# EAGLE schematic magarray_v1 (EAGLE 6.5.0)
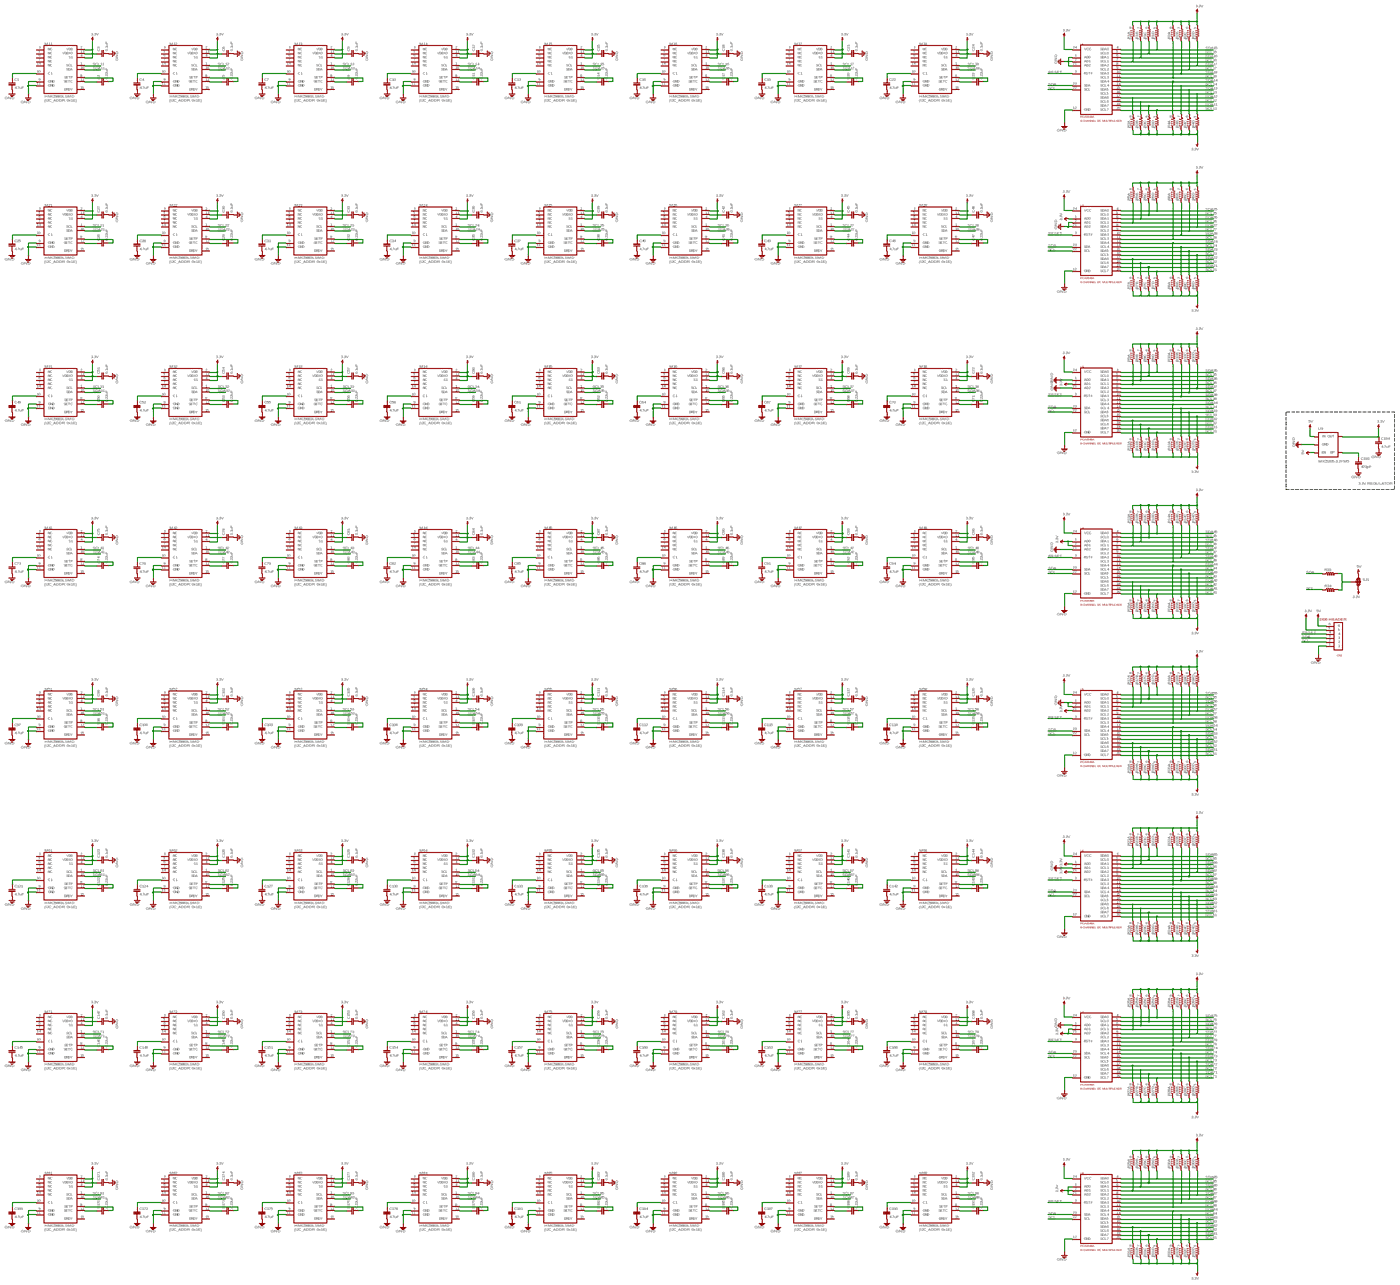
[diagram p0: schematic, sheet 1, overview]
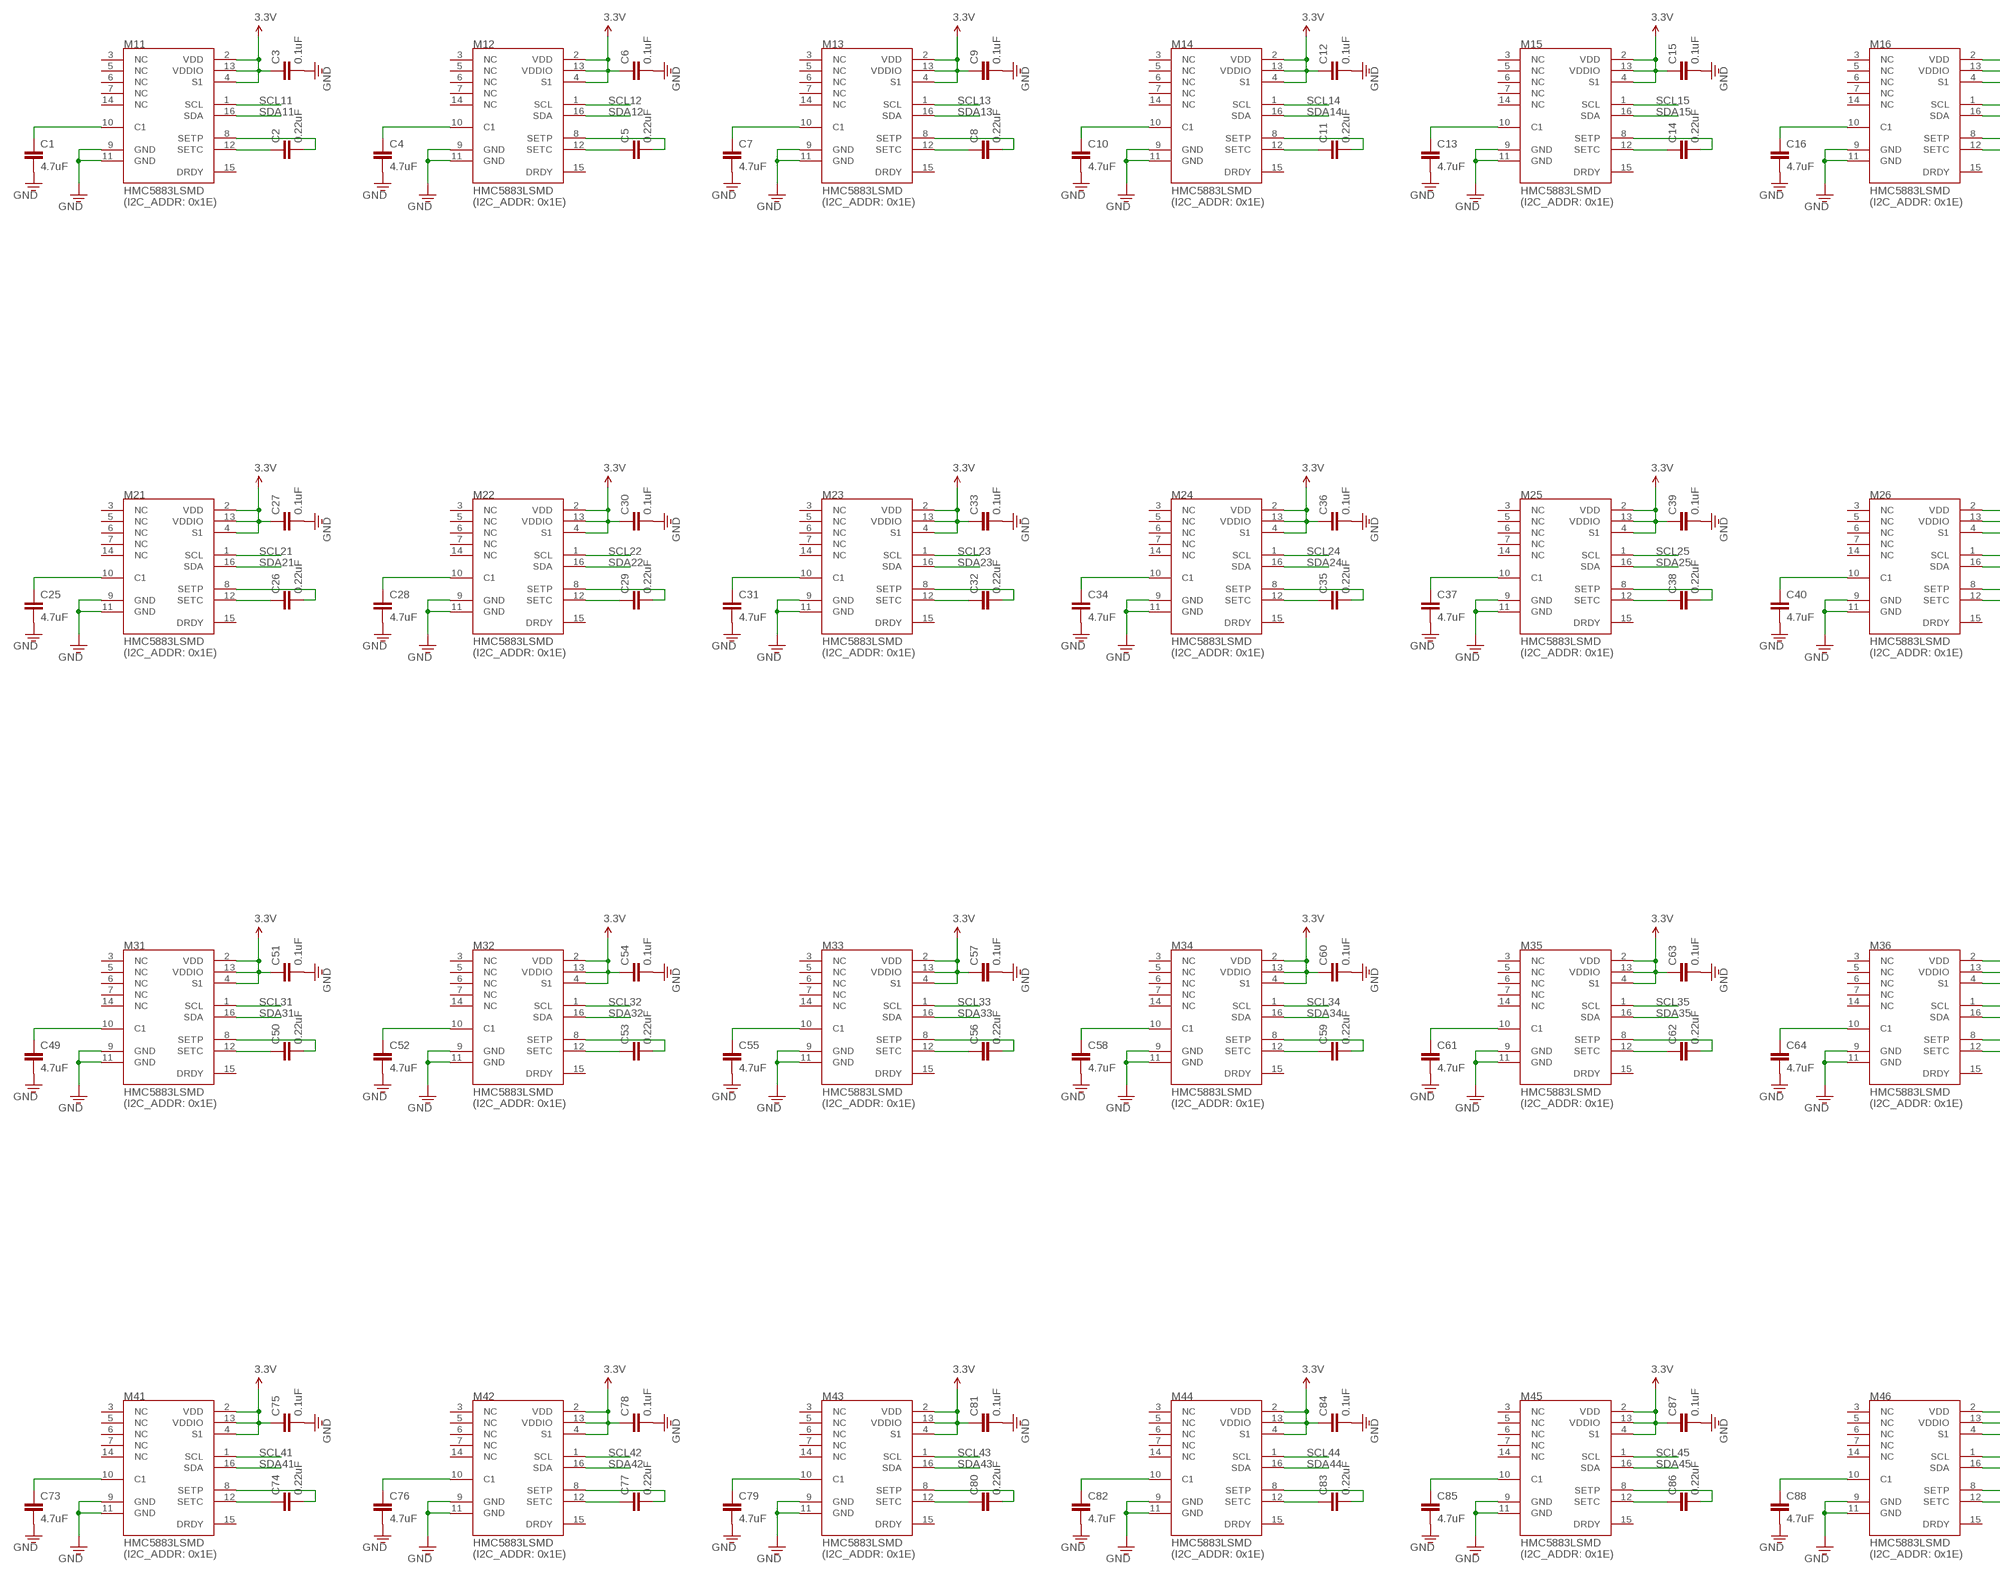
[diagram p1: schematic, sheet 1, part 1 of 4]
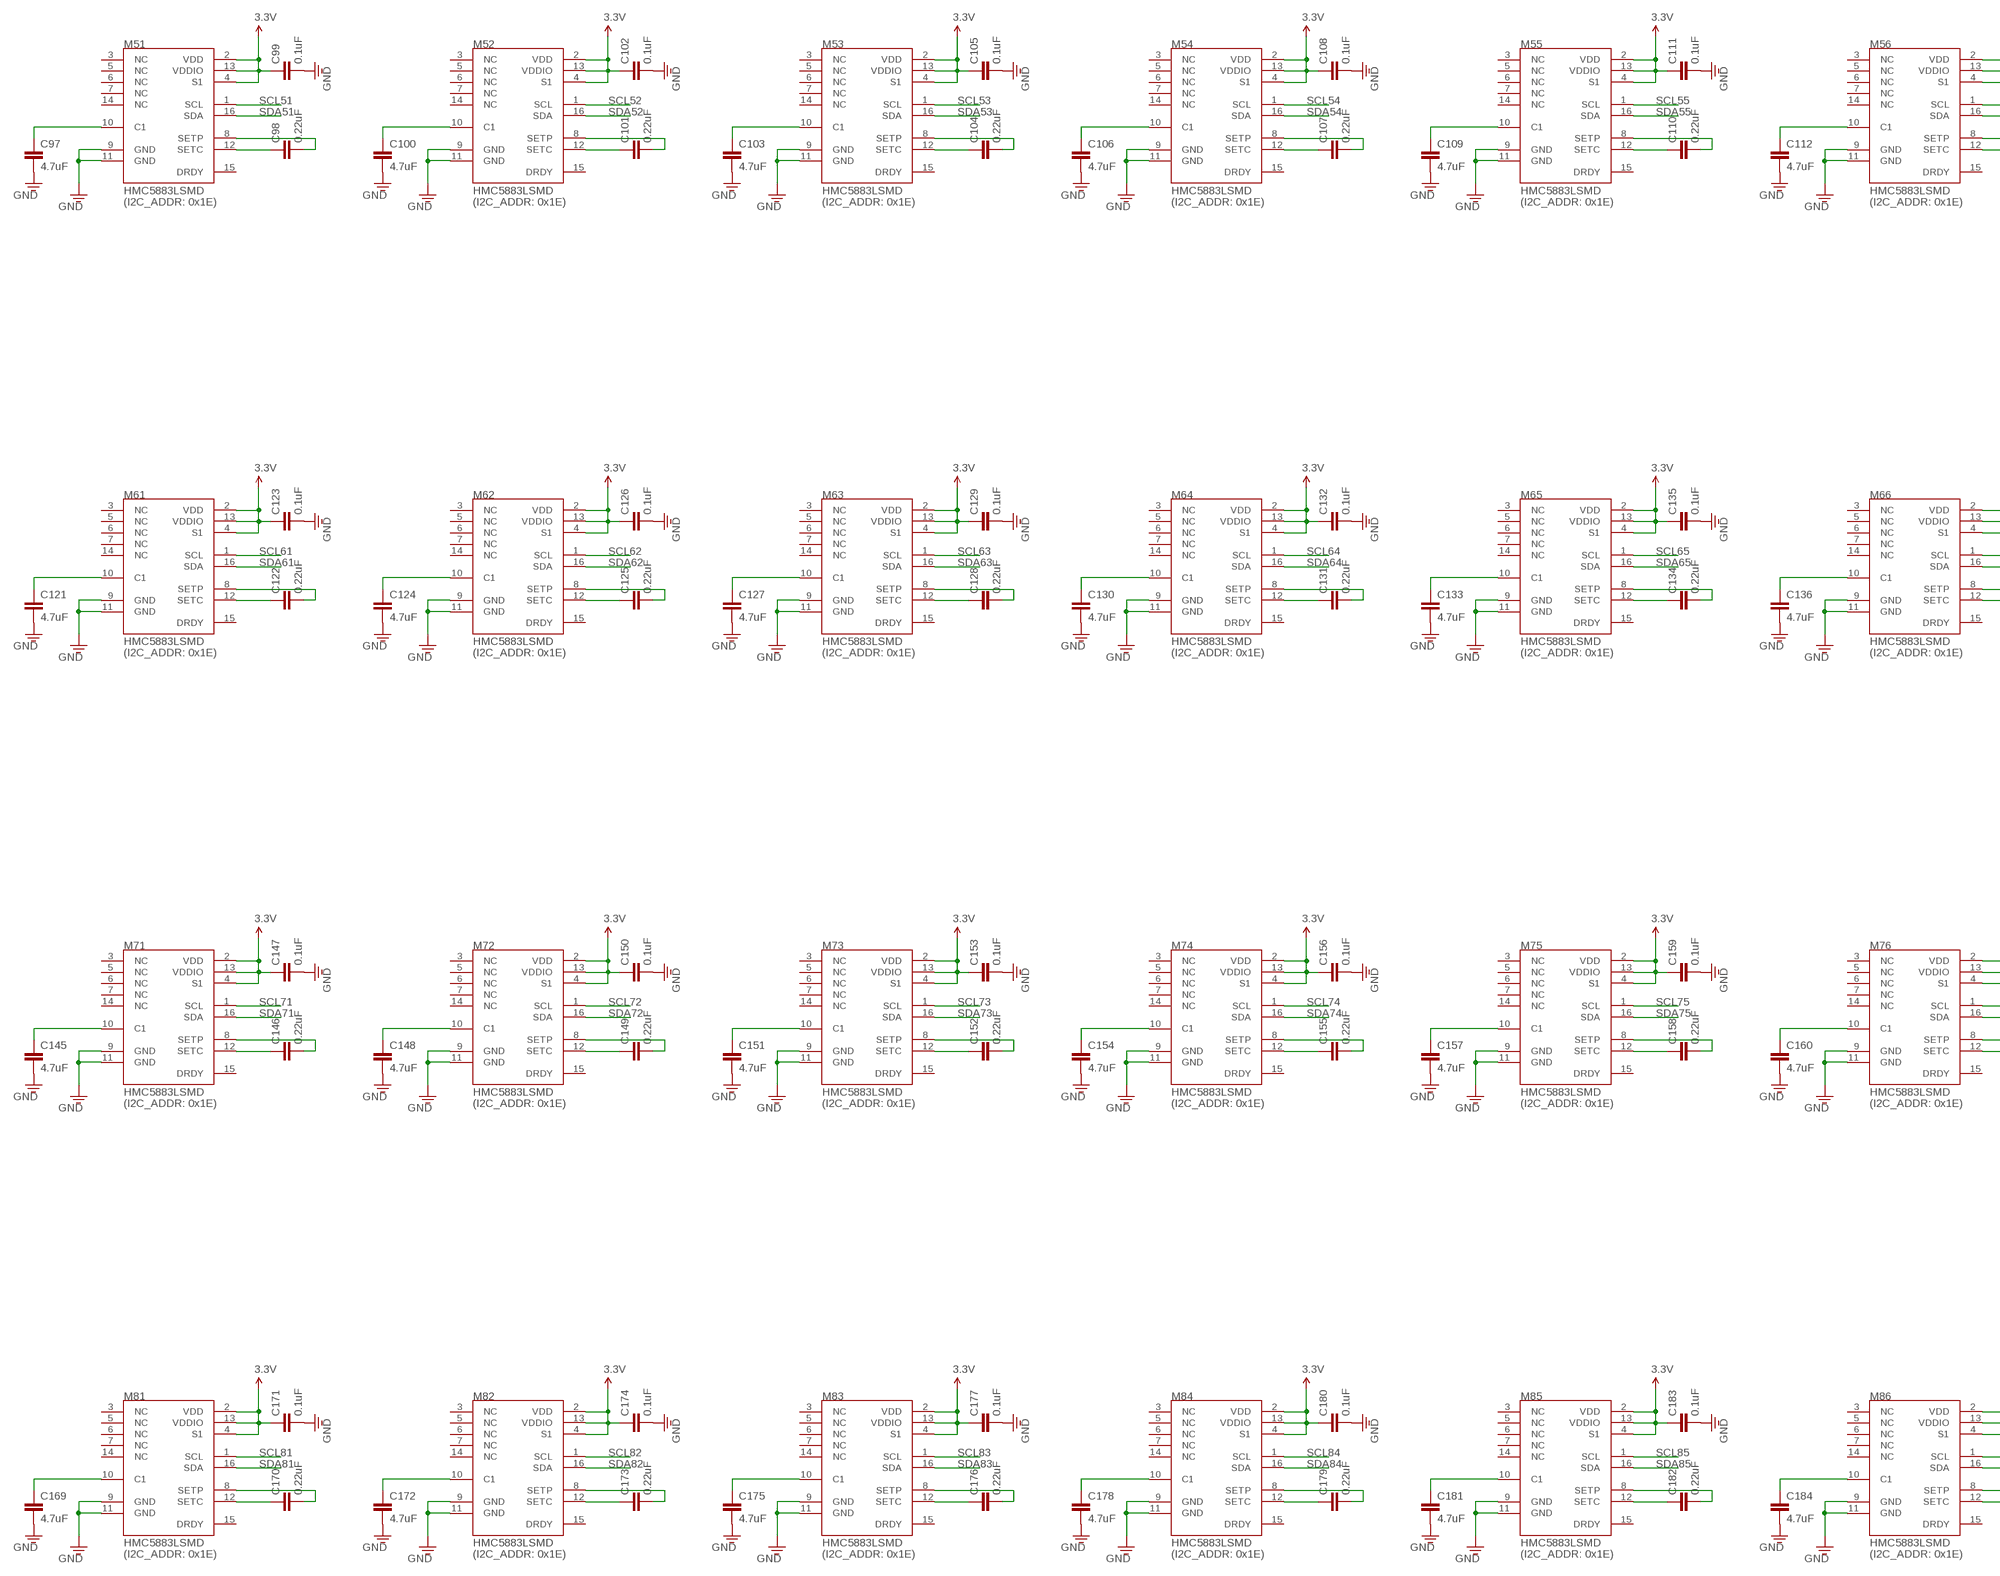
[diagram p2: schematic, sheet 1, part 2 of 4]
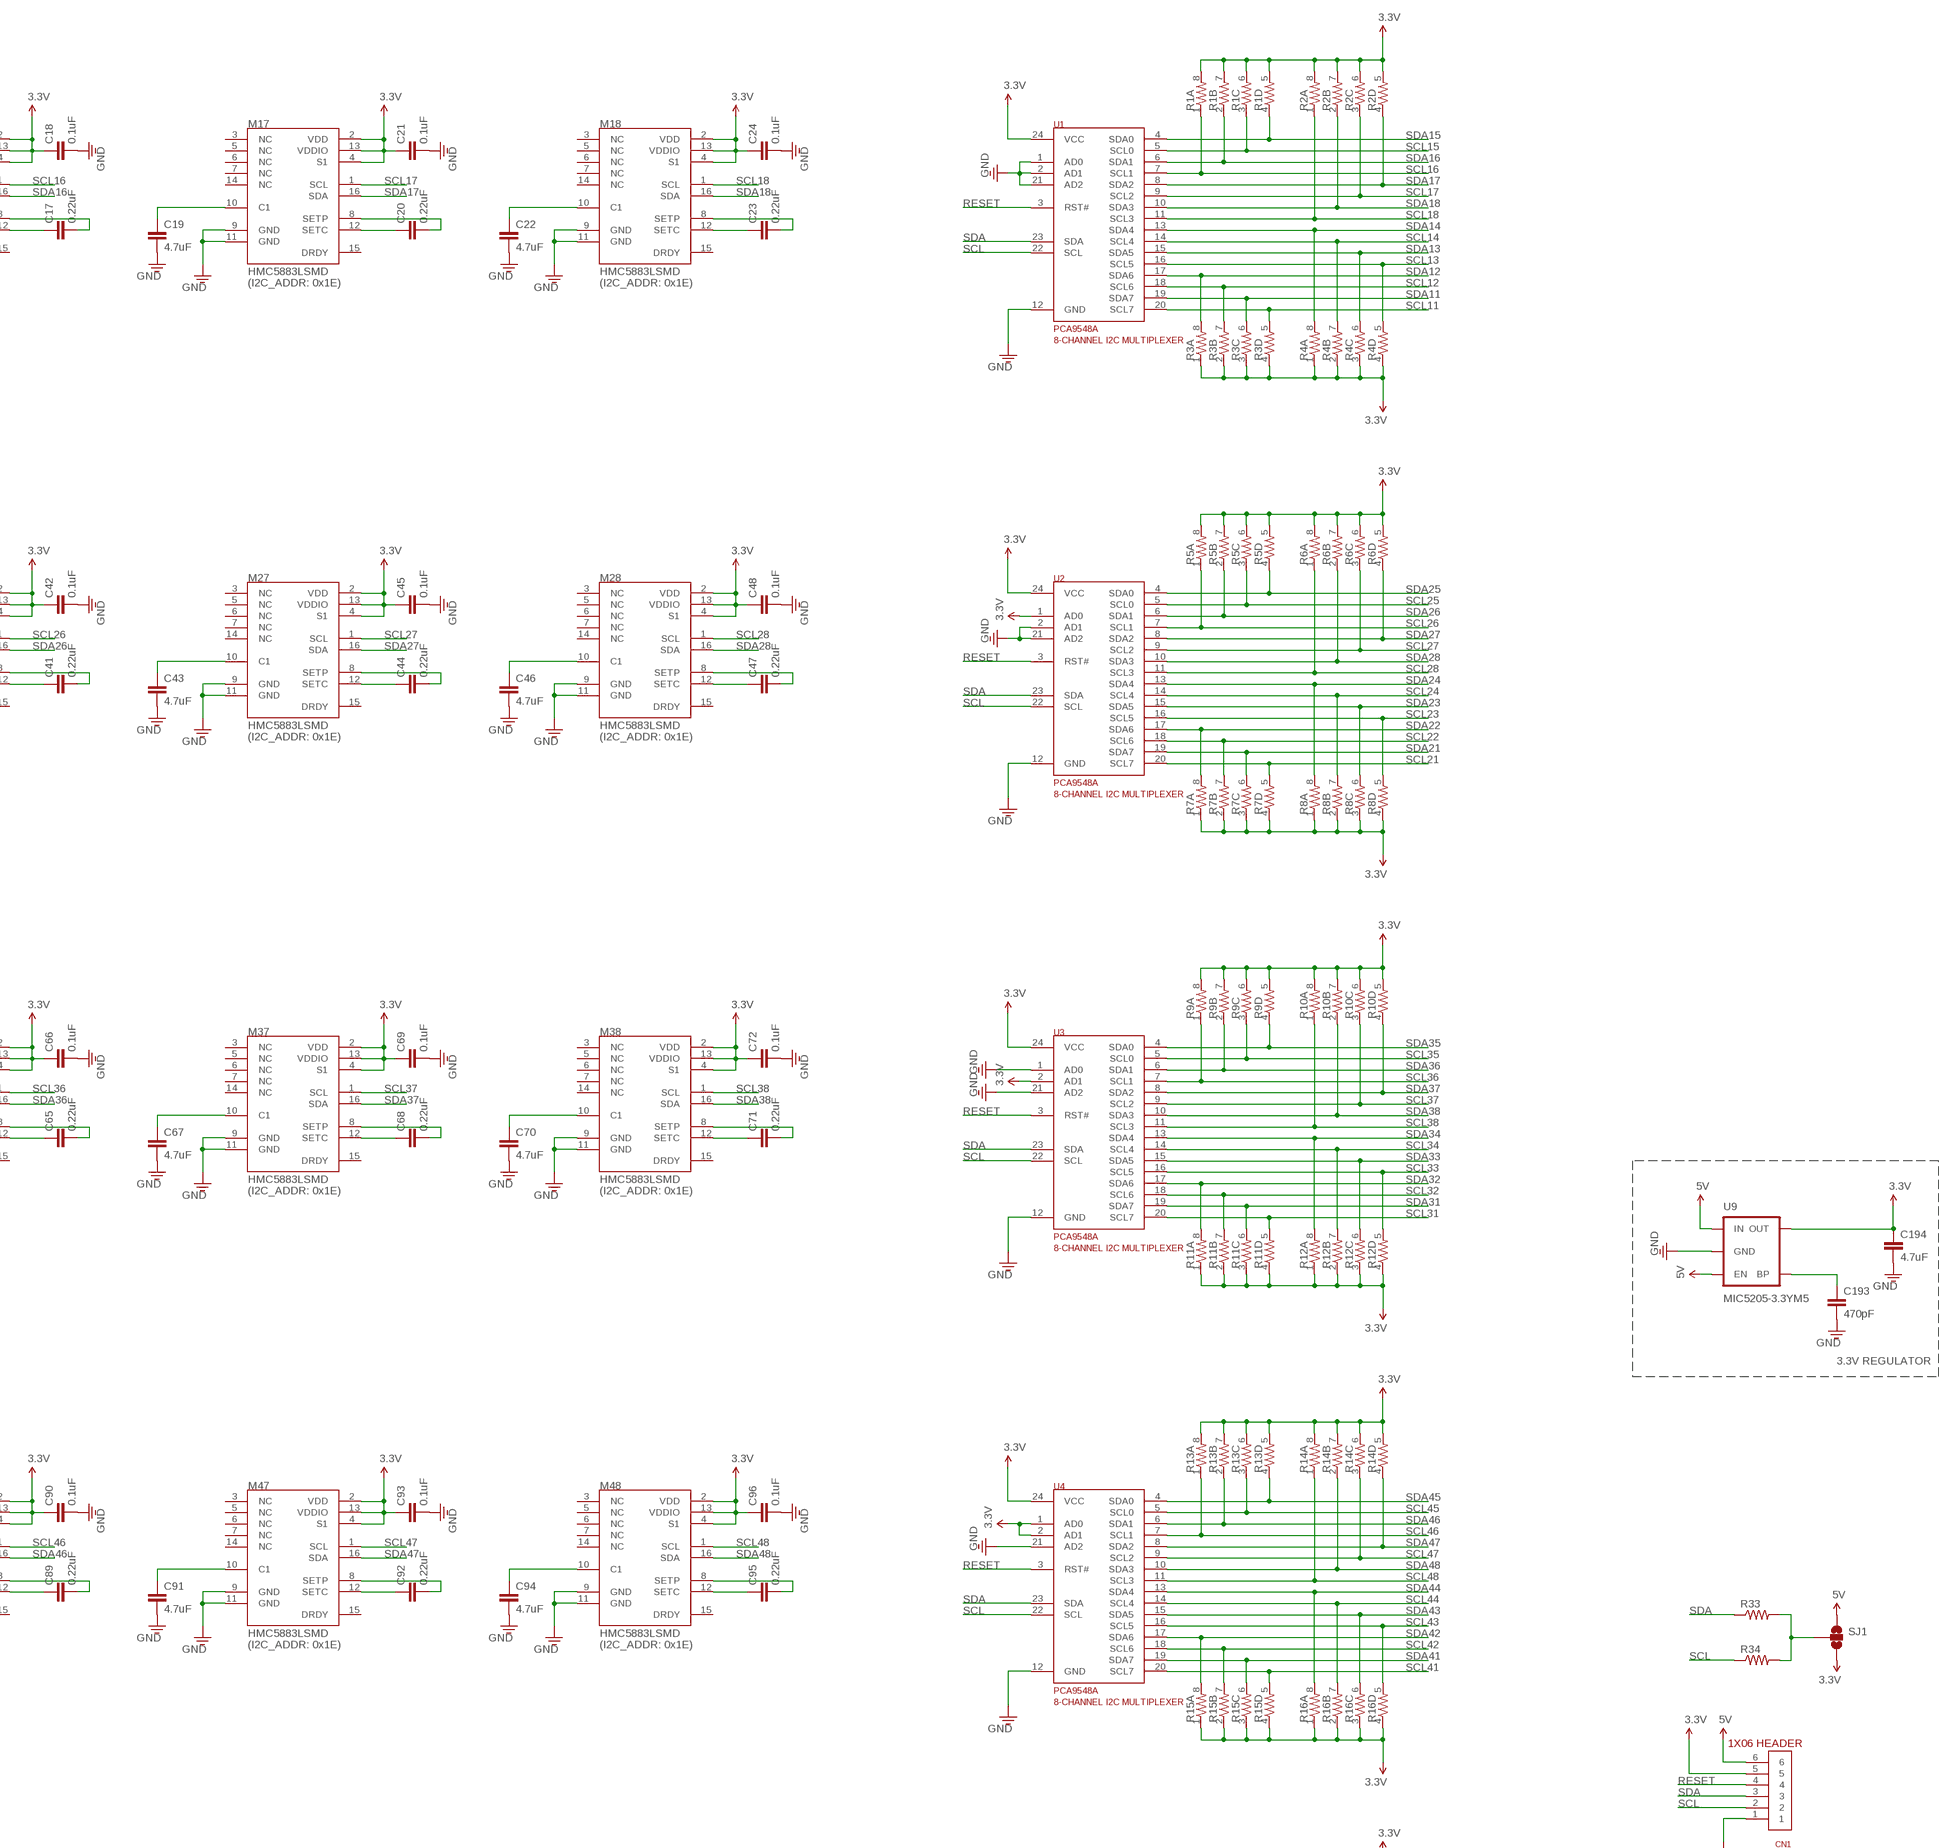
[diagram p3: schematic, sheet 1, part 3 of 4]
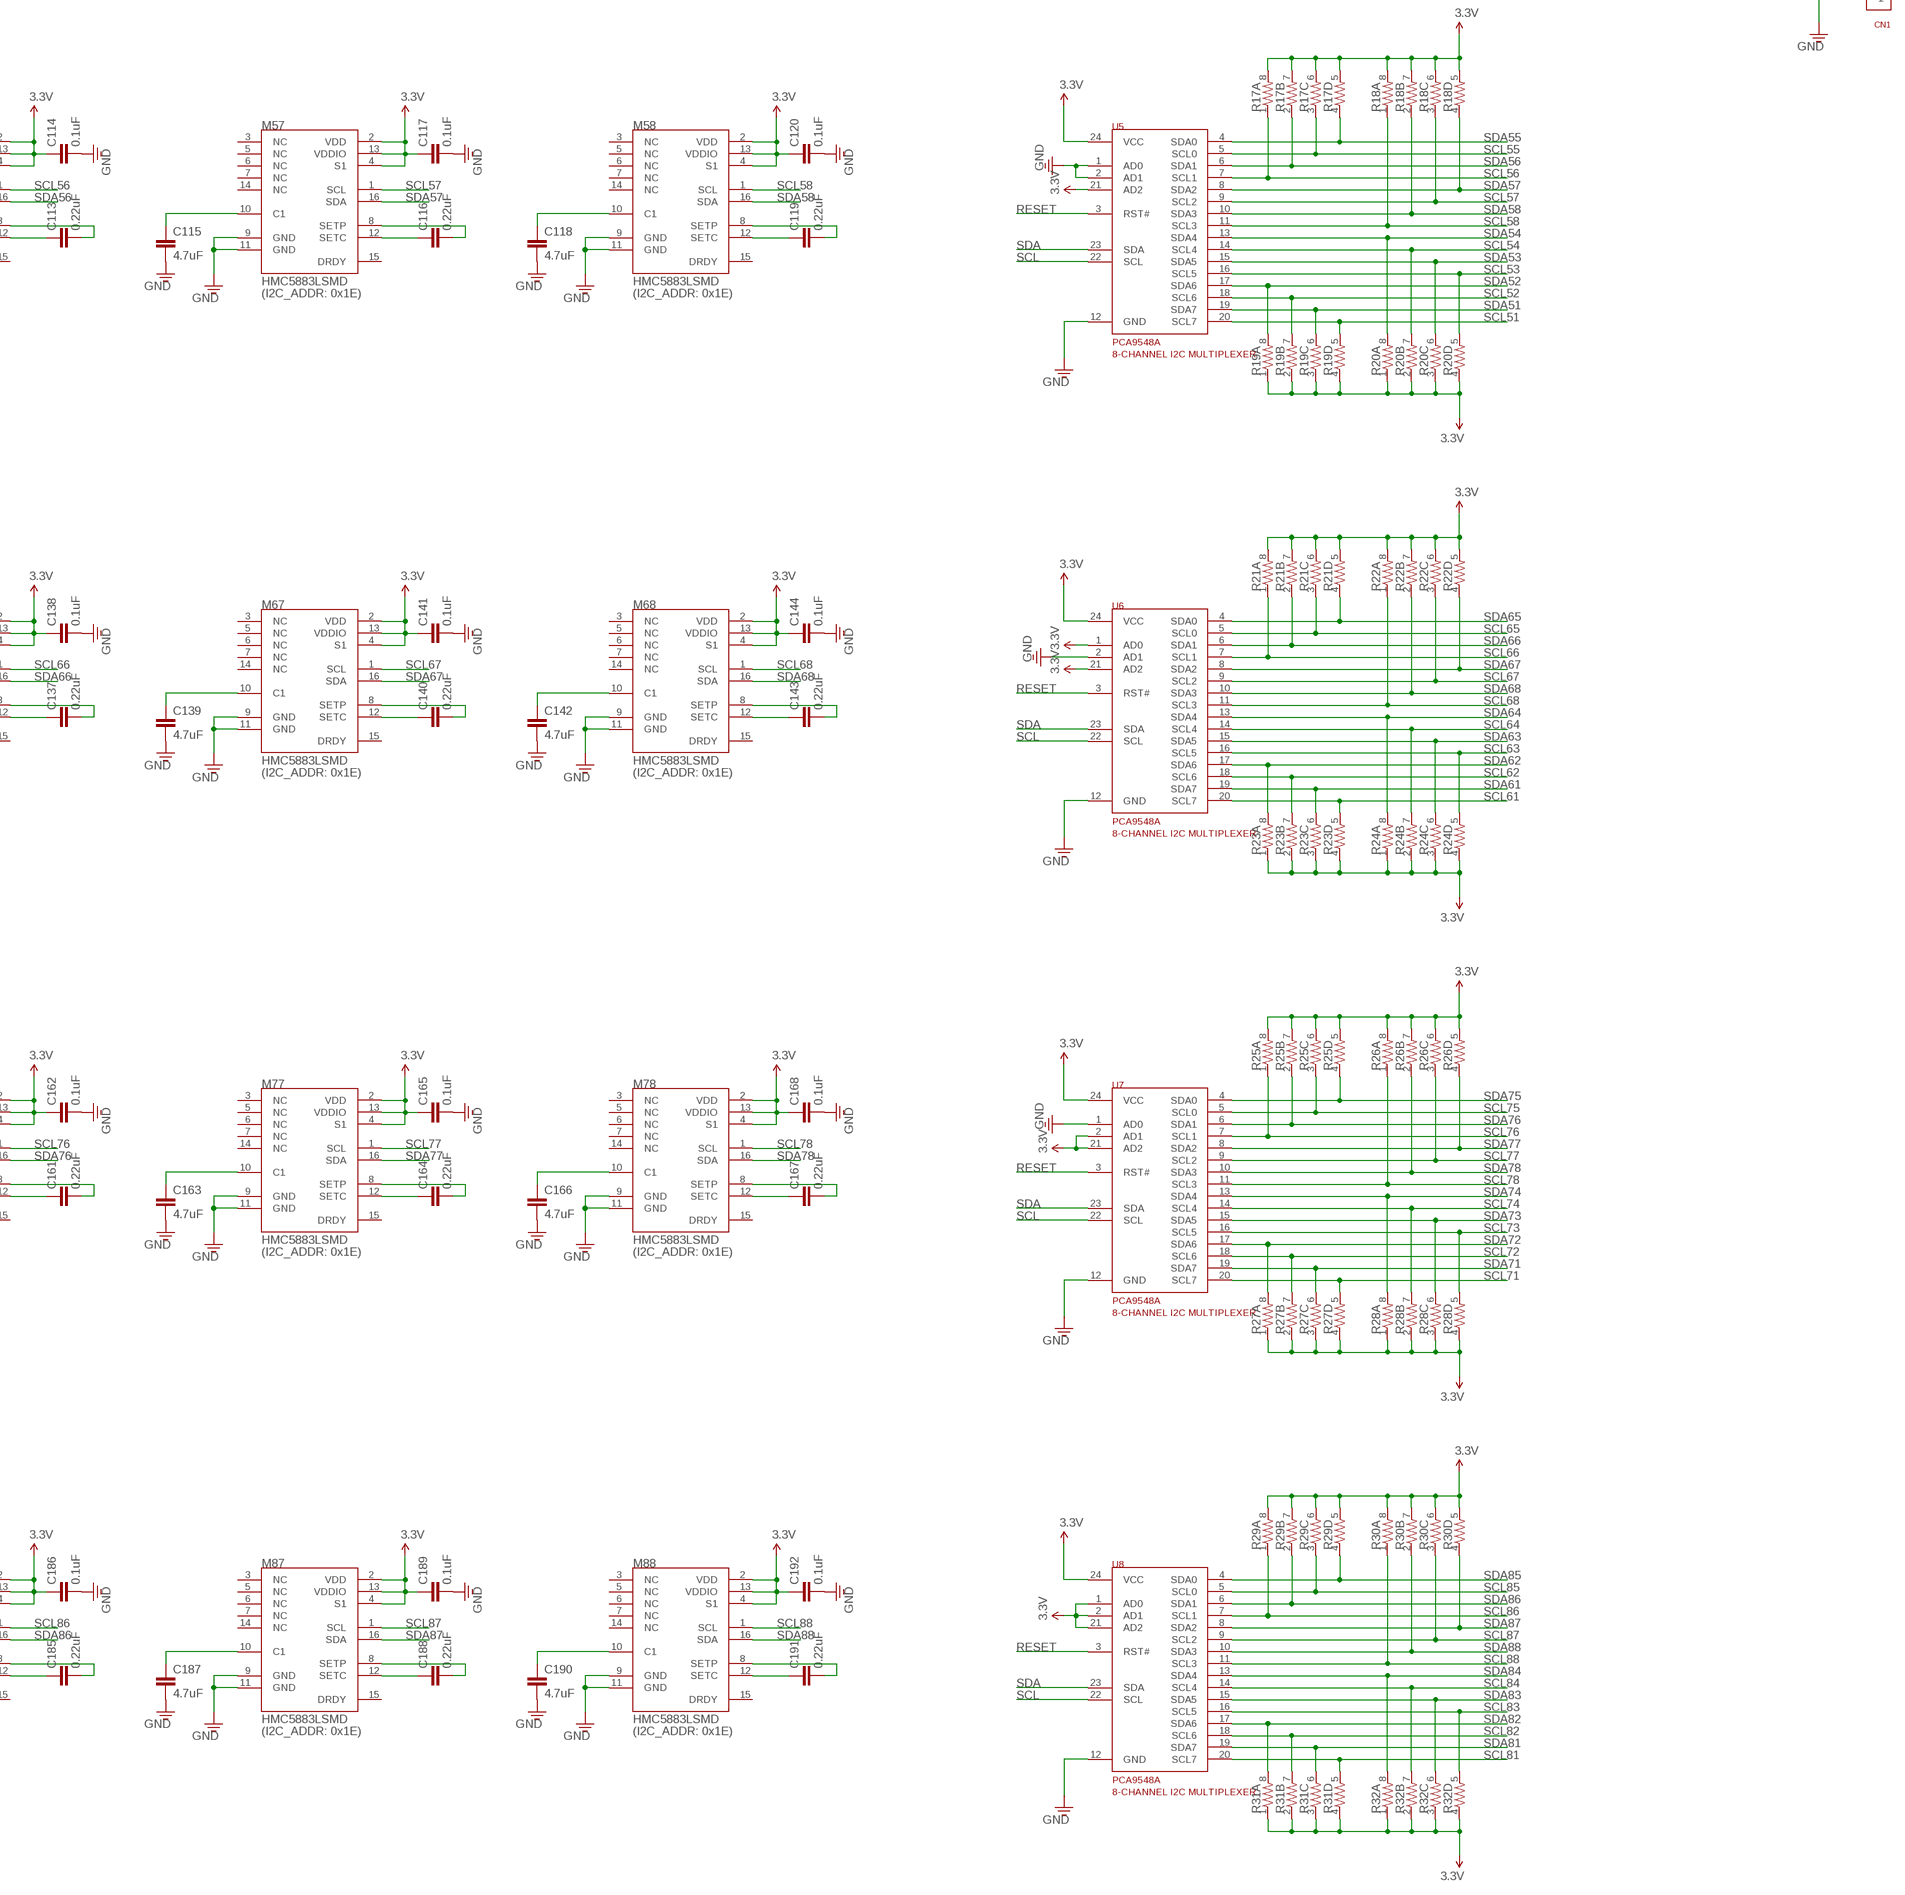
[diagram p4: schematic, sheet 1, part 4 of 4]

## Parts
C1  4.7uF  CAP0603  [0603]
C2  0.22uF  CAP0402  [C0402]
C3  0.1uF  CAP0402  [C0402]
C4  4.7uF  CAP0603  [0603]
C5  0.22uF  CAP0402  [C0402]
C6  0.1uF  CAP0402  [C0402]
C7  4.7uF  CAP0603  [0603]
C8  0.22uF  CAP0402  [C0402]
C9  0.1uF  CAP0402  [C0402]
C10  4.7uF  CAP0603  [0603]
C11  0.22uF  CAP0402  [C0402]
C12  0.1uF  CAP0402  [C0402]
C13  4.7uF  CAP0603  [0603]
C14  0.22uF  CAP0402  [C0402]
C15  0.1uF  CAP0402  [C0402]
C16  4.7uF  CAP0603  [0603]
C17  0.22uF  CAP0402  [C0402]
C18  0.1uF  CAP0402  [C0402]
C19  4.7uF  CAP0603  [0603]
C20  0.22uF  CAP0402  [C0402]
C21  0.1uF  CAP0402  [C0402]
C22  4.7uF  CAP0603  [0603]
C23  0.22uF  CAP0402  [C0402]
C24  0.1uF  CAP0402  [C0402]
C25  4.7uF  CAP0603  [0603]
C26  0.22uF  CAP0402  [C0402]
C27  0.1uF  CAP0402  [C0402]
C28  4.7uF  CAP0603  [0603]
C29  0.22uF  CAP0402  [C0402]
C30  0.1uF  CAP0402  [C0402]
C31  4.7uF  CAP0603  [0603]
C32  0.22uF  CAP0402  [C0402]
C33  0.1uF  CAP0402  [C0402]
C34  4.7uF  CAP0603  [0603]
C35  0.22uF  CAP0402  [C0402]
C36  0.1uF  CAP0402  [C0402]
C37  4.7uF  CAP0603  [0603]
C38  0.22uF  CAP0402  [C0402]
C39  0.1uF  CAP0402  [C0402]
C40  4.7uF  CAP0603  [0603]
C41  0.22uF  CAP0402  [C0402]
C42  0.1uF  CAP0402  [C0402]
C43  4.7uF  CAP0603  [0603]
C44  0.22uF  CAP0402  [C0402]
C45  0.1uF  CAP0402  [C0402]
C46  4.7uF  CAP0603  [0603]
C47  0.22uF  CAP0402  [C0402]
C48  0.1uF  CAP0402  [C0402]
C49  4.7uF  CAP0603  [0603]
C50  0.22uF  CAP0402  [C0402]
C51  0.1uF  CAP0402  [C0402]
C52  4.7uF  CAP0603  [0603]
C53  0.22uF  CAP0402  [C0402]
C54  0.1uF  CAP0402  [C0402]
C55  4.7uF  CAP0603  [0603]
C56  0.22uF  CAP0402  [C0402]
C57  0.1uF  CAP0402  [C0402]
C58  4.7uF  CAP0603  [0603]
C59  0.22uF  CAP0402  [C0402]
C60  0.1uF  CAP0402  [C0402]
C61  4.7uF  CAP0603  [0603]
C62  0.22uF  CAP0402  [C0402]
C63  0.1uF  CAP0402  [C0402]
C64  4.7uF  CAP0603  [0603]
C65  0.22uF  CAP0402  [C0402]
C66  0.1uF  CAP0402  [C0402]
C67  4.7uF  CAP0603  [0603]
C68  0.22uF  CAP0402  [C0402]
C69  0.1uF  CAP0402  [C0402]
C70  4.7uF  CAP0603  [0603]
C71  0.22uF  CAP0402  [C0402]
C72  0.1uF  CAP0402  [C0402]
C73  4.7uF  CAP0603  [0603]
C74  0.22uF  CAP0402  [C0402]
C75  0.1uF  CAP0402  [C0402]
C76  4.7uF  CAP0603  [0603]
C77  0.22uF  CAP0402  [C0402]
C78  0.1uF  CAP0402  [C0402]
C79  4.7uF  CAP0603  [0603]
C80  0.22uF  CAP0402  [C0402]
C81  0.1uF  CAP0402  [C0402]
C82  4.7uF  CAP0603  [0603]
C83  0.22uF  CAP0402  [C0402]
C84  0.1uF  CAP0402  [C0402]
C85  4.7uF  CAP0603  [0603]
C86  0.22uF  CAP0402  [C0402]
C87  0.1uF  CAP0402  [C0402]
C88  4.7uF  CAP0603  [0603]
C89  0.22uF  CAP0402  [C0402]
C90  0.1uF  CAP0402  [C0402]
C91  4.7uF  CAP0603  [0603]
C92  0.22uF  CAP0402  [C0402]
C93  0.1uF  CAP0402  [C0402]
C94  4.7uF  CAP0603  [0603]
C95  0.22uF  CAP0402  [C0402]
C96  0.1uF  CAP0402  [C0402]
C97  4.7uF  CAP0603  [0603]
C98  0.22uF  CAP0402  [C0402]
C99  0.1uF  CAP0402  [C0402]
C100  4.7uF  CAP0603  [0603]
C101  0.22uF  CAP0402  [C0402]
C102  0.1uF  CAP0402  [C0402]
C103  4.7uF  CAP0603  [0603]
C104  0.22uF  CAP0402  [C0402]
C105  0.1uF  CAP0402  [C0402]
C106  4.7uF  CAP0603  [0603]
C107  0.22uF  CAP0402  [C0402]
C108  0.1uF  CAP0402  [C0402]
C109  4.7uF  CAP0603  [0603]
C110  0.22uF  CAP0402  [C0402]
C111  0.1uF  CAP0402  [C0402]
C112  4.7uF  CAP0603  [0603]
C113  0.22uF  CAP0402  [C0402]
C114  0.1uF  CAP0402  [C0402]
C115  4.7uF  CAP0603  [0603]
C116  0.22uF  CAP0402  [C0402]
C117  0.1uF  CAP0402  [C0402]
C118  4.7uF  CAP0603  [0603]
C119  0.22uF  CAP0402  [C0402]
C120  0.1uF  CAP0402  [C0402]
C121  4.7uF  CAP0603  [0603]
C122  0.22uF  CAP0402  [C0402]
C123  0.1uF  CAP0402  [C0402]
C124  4.7uF  CAP0603  [0603]
C125  0.22uF  CAP0402  [C0402]
C126  0.1uF  CAP0402  [C0402]
C127  4.7uF  CAP0603  [0603]
C128  0.22uF  CAP0402  [C0402]
C129  0.1uF  CAP0402  [C0402]
C130  4.7uF  CAP0603  [0603]
C131  0.22uF  CAP0402  [C0402]
C132  0.1uF  CAP0402  [C0402]
C133  4.7uF  CAP0603  [0603]
C134  0.22uF  CAP0402  [C0402]
C135  0.1uF  CAP0402  [C0402]
C136  4.7uF  CAP0603  [0603]
C137  0.22uF  CAP0402  [C0402]
C138  0.1uF  CAP0402  [C0402]
C139  4.7uF  CAP0603  [0603]
C140  0.22uF  CAP0402  [C0402]
C141  0.1uF  CAP0402  [C0402]
C142  4.7uF  CAP0603  [0603]
C143  0.22uF  CAP0402  [C0402]
C144  0.1uF  CAP0402  [C0402]
C145  4.7uF  CAP0603  [0603]
C146  0.22uF  CAP0402  [C0402]
C147  0.1uF  CAP0402  [C0402]
C148  4.7uF  CAP0603  [0603]
C149  0.22uF  CAP0402  [C0402]
C150  0.1uF  CAP0402  [C0402]
C151  4.7uF  CAP0603  [0603]
C152  0.22uF  CAP0402  [C0402]
C153  0.1uF  CAP0402  [C0402]
C154  4.7uF  CAP0603  [0603]
C155  0.22uF  CAP0402  [C0402]
C156  0.1uF  CAP0402  [C0402]
C157  4.7uF  CAP0603  [0603]
C158  0.22uF  CAP0402  [C0402]
C159  0.1uF  CAP0402  [C0402]
C160  4.7uF  CAP0603  [0603]
C161  0.22uF  CAP0402  [C0402]
C162  0.1uF  CAP0402  [C0402]
C163  4.7uF  CAP0603  [0603]
C164  0.22uF  CAP0402  [C0402]
C165  0.1uF  CAP0402  [C0402]
C166  4.7uF  CAP0603  [0603]
C167  0.22uF  CAP0402  [C0402]
C168  0.1uF  CAP0402  [C0402]
C169  4.7uF  CAP0603  [0603]
C170  0.22uF  CAP0402  [C0402]
C171  0.1uF  CAP0402  [C0402]
C172  4.7uF  CAP0603  [0603]
C173  0.22uF  CAP0402  [C0402]
C174  0.1uF  CAP0402  [C0402]
C175  4.7uF  CAP0603  [0603]
C176  0.22uF  CAP0402  [C0402]
C177  0.1uF  CAP0402  [C0402]
C178  4.7uF  CAP0603  [0603]
C179  0.22uF  CAP0402  [C0402]
C180  0.1uF  CAP0402  [C0402]
C181  4.7uF  CAP0603  [0603]
C182  0.22uF  CAP0402  [C0402]
C183  0.1uF  CAP0402  [C0402]
C184  4.7uF  CAP0603  [0603]
C185  0.22uF  CAP0402  [C0402]
C186  0.1uF  CAP0402  [C0402]
C187  4.7uF  CAP0603  [0603]
C188  0.22uF  CAP0402  [C0402]
C189  0.1uF  CAP0402  [C0402]
C190  4.7uF  CAP0603  [0603]
C191  0.22uF  CAP0402  [C0402]
C192  0.1uF  CAP0402  [C0402]
C193  470pF  CAP0402  [C0402]
C194  4.7uF  CAP0402  [C0402]
CN1  1X06  [1X06]
M11  HMC5883LSMD  [16LPCC]
M12  HMC5883LSMD  [16LPCC]
M13  HMC5883LSMD  [16LPCC]
M14  HMC5883LSMD  [16LPCC]
M15  HMC5883LSMD  [16LPCC]
M16  HMC5883LSMD  [16LPCC]
M17  HMC5883LSMD  [16LPCC]
M18  HMC5883LSMD  [16LPCC]
M21  HMC5883LSMD  [16LPCC]
M22  HMC5883LSMD  [16LPCC]
M23  HMC5883LSMD  [16LPCC]
M24  HMC5883LSMD  [16LPCC]
M25  HMC5883LSMD  [16LPCC]
M26  HMC5883LSMD  [16LPCC]
M27  HMC5883LSMD  [16LPCC]
M28  HMC5883LSMD  [16LPCC]
M31  HMC5883LSMD  [16LPCC]
M32  HMC5883LSMD  [16LPCC]
M33  HMC5883LSMD  [16LPCC]
M34  HMC5883LSMD  [16LPCC]
M35  HMC5883LSMD  [16LPCC]
M36  HMC5883LSMD  [16LPCC]
M37  HMC5883LSMD  [16LPCC]
M38  HMC5883LSMD  [16LPCC]
M41  HMC5883LSMD  [16LPCC]
M42  HMC5883LSMD  [16LPCC]
M43  HMC5883LSMD  [16LPCC]
M44  HMC5883LSMD  [16LPCC]
M45  HMC5883LSMD  [16LPCC]
M46  HMC5883LSMD  [16LPCC]
M47  HMC5883LSMD  [16LPCC]
M48  HMC5883LSMD  [16LPCC]
M51  HMC5883LSMD  [16LPCC]
M52  HMC5883LSMD  [16LPCC]
M53  HMC5883LSMD  [16LPCC]
M54  HMC5883LSMD  [16LPCC]
M55  HMC5883LSMD  [16LPCC]
M56  HMC5883LSMD  [16LPCC]
M57  HMC5883LSMD  [16LPCC]
M58  HMC5883LSMD  [16LPCC]
M61  HMC5883LSMD  [16LPCC]
M62  HMC5883LSMD  [16LPCC]
M63  HMC5883LSMD  [16LPCC]
M64  HMC5883LSMD  [16LPCC]
M65  HMC5883LSMD  [16LPCC]
M66  HMC5883LSMD  [16LPCC]
M67  HMC5883LSMD  [16LPCC]
M68  HMC5883LSMD  [16LPCC]
M71  HMC5883LSMD  [16LPCC]
M72  HMC5883LSMD  [16LPCC]
M73  HMC5883LSMD  [16LPCC]
M74  HMC5883LSMD  [16LPCC]
M75  HMC5883LSMD  [16LPCC]
M76  HMC5883LSMD  [16LPCC]
M77  HMC5883LSMD  [16LPCC]
M78  HMC5883LSMD  [16LPCC]
M81  HMC5883LSMD  [16LPCC]
M82  HMC5883LSMD  [16LPCC]
M83  HMC5883LSMD  [16LPCC]
M84  HMC5883LSMD  [16LPCC]
M85  HMC5883LSMD  [16LPCC]
M86  HMC5883LSMD  [16LPCC]
M87  HMC5883LSMD  [16LPCC]
M88  HMC5883LSMD  [16LPCC]
R1  RESISTOR-ARRAY0603-ARV  [0603-ARV]
R2  RESISTOR-ARRAY0603-ARV  [0603-ARV]
R3  RESISTOR-ARRAY0603-ARV  [0603-ARV]
R4  RESISTOR-ARRAY0603-ARV  [0603-ARV]
R5  RESISTOR-ARRAY0603-ARV  [0603-ARV]
R6  RESISTOR-ARRAY0603-ARV  [0603-ARV]
R7  RESISTOR-ARRAY0603-ARV  [0603-ARV]
R8  RESISTOR-ARRAY0603-ARV  [0603-ARV]
R9  RESISTOR-ARRAY0603-ARV  [0603-ARV]
R10  RESISTOR-ARRAY0603-ARV  [0603-ARV]
R11  RESISTOR-ARRAY0603-ARV  [0603-ARV]
R12  RESISTOR-ARRAY0603-ARV  [0603-ARV]
R13  RESISTOR-ARRAY0603-ARV  [0603-ARV]
R14  RESISTOR-ARRAY0603-ARV  [0603-ARV]
R15  RESISTOR-ARRAY0603-ARV  [0603-ARV]
R16  RESISTOR-ARRAY0603-ARV  [0603-ARV]
R17  RESISTOR-ARRAY0603-ARV  [0603-ARV]
R18  RESISTOR-ARRAY0603-ARV  [0603-ARV]
R19  RESISTOR-ARRAY0603-ARV  [0603-ARV]
R20  RESISTOR-ARRAY0603-ARV  [0603-ARV]
R21  RESISTOR-ARRAY0603-ARV  [0603-ARV]
R22  RESISTOR-ARRAY0603-ARV  [0603-ARV]
R23  RESISTOR-ARRAY0603-ARV  [0603-ARV]
R24  RESISTOR-ARRAY0603-ARV  [0603-ARV]
R25  RESISTOR-ARRAY0603-ARV  [0603-ARV]
R26  RESISTOR-ARRAY0603-ARV  [0603-ARV]
R27  RESISTOR-ARRAY0603-ARV  [0603-ARV]
R28  RESISTOR-ARRAY0603-ARV  [0603-ARV]
R29  RESISTOR-ARRAY0603-ARV  [0603-ARV]
R30  RESISTOR-ARRAY0603-ARV  [0603-ARV]
R31  RESISTOR-ARRAY0603-ARV  [0603-ARV]
R32  RESISTOR-ARRAY0603-ARV  [0603-ARV]
R33  RESISTOR0603  [0603]
R34  RESISTOR0603  [0603]
SJ1  SOLDERJUMPER_2WAYPASTE1&2  [SJ_3_PASTE1&2]
U1  TCA9548A  [TSSOP-24-4.4MM]
U2  TCA9548A  [TSSOP-24-4.4MM]
U3  TCA9548A  [TSSOP-24-4.4MM]
U4  TCA9548A  [TSSOP-24-4.4MM]
U5  TCA9548A  [TSSOP-24-4.4MM]
U6  TCA9548A  [TSSOP-24-4.4MM]
U7  TCA9548A  [TSSOP-24-4.4MM]
U8  TCA9548A  [TSSOP-24-4.4MM]
U9  MIC5205-3.3YM5  V_REG_LDOSMD  [SOT23-5]

## Nets
3.3V: C3.1 C6.1 C9.1 C12.1 C15.1 C18.1 C21.1 C24.1 C27.1 C30.1 C33.1 C36.1 C39.1 C42.1 C45.1 C48.1 C51.1 C54.1 C57.1 C60.1 C63.1 C66.1 C69.1 C72.1 C75.1 C78.1 C81.1 C84.1 C87.1 C90.1 C93.1 C96.1 C99.1 C102.1 C105.1 C108.1 C111.1 C114.1 C117.1 C120.1 C123.1 C126.1 C129.1 C132.1 C135.1 C138.1 C141.1 C144.1 C147.1 C150.1 C153.1 C156.1 C159.1 C162.1 C165.1 C168.1 C171.1 C174.1 C177.1 C180.1 C183.1 C186.1 C189.1 C192.1 C194.1 CN1.5 M11.2(VDD) M11.4(S1) M11.13(VDDIO) M12.2(VDD) M12.4(S1) M12.13(VDDIO) M13.2(VDD) M13.4(S1) M13.13(VDDIO) M14.2(VDD) M14.4(S1) M14.13(VDDIO) M15.2(VDD) M15.4(S1) M15.13(VDDIO) M16.2(VDD) M16.4(S1) M16.13(VDDIO) M17.2(VDD) M17.4(S1) M17.13(VDDIO) M18.2(VDD) M18.4(S1) M18.13(VDDIO) M21.2(VDD) M21.4(S1) M21.13(VDDIO) M22.2(VDD) M22.4(S1) M22.13(VDDIO) M23.2(VDD) M23.4(S1) M23.13(VDDIO) M24.2(VDD) M24.4(S1) M24.13(VDDIO) M25.2(VDD) M25.4(S1) M25.13(VDDIO) M26.2(VDD) M26.4(S1) M26.13(VDDIO) M27.2(VDD) M27.4(S1) M27.13(VDDIO) M28.2(VDD) M28.4(S1) M28.13(VDDIO) M31.2(VDD) M31.4(S1) M31.13(VDDIO) M32.2(VDD) M32.4(S1) M32.13(VDDIO) M33.2(VDD) M33.4(S1) M33.13(VDDIO) M34.2(VDD) M34.4(S1) M34.13(VDDIO) M35.2(VDD) M35.4(S1) M35.13(VDDIO) M36.2(VDD) M36.4(S1) M36.13(VDDIO) M37.2(VDD) M37.4(S1) M37.13(VDDIO) M38.2(VDD) M38.4(S1) M38.13(VDDIO) M41.2(VDD) M41.4(S1) M41.13(VDDIO) M42.2(VDD) M42.4(S1) M42.13(VDDIO) M43.2(VDD) M43.4(S1) M43.13(VDDIO) M44.2(VDD) M44.4(S1) M44.13(VDDIO) M45.2(VDD) M45.4(S1) M45.13(VDDIO) M46.2(VDD) M46.4(S1) M46.13(VDDIO) M47.2(VDD) M47.4(S1) M47.13(VDDIO) M48.2(VDD) M48.4(S1) M48.13(VDDIO) M51.2(VDD) M51.4(S1) M51.13(VDDIO) M52.2(VDD) M52.4(S1) M52.13(VDDIO) M53.2(VDD) M53.4(S1) M53.13(VDDIO) M54.2(VDD) M54.4(S1) M54.13(VDDIO) M55.2(VDD) M55.4(S1) M55.13(VDDIO) M56.2(VDD) M56.4(S1) M56.13(VDDIO) M57.2(VDD) M57.4(S1) M57.13(VDDIO) M58.2(VDD) M58.4(S1) M58.13(VDDIO) M61.2(VDD) M61.4(S1) M61.13(VDDIO) M62.2(VDD) M62.4(S1) M62.13(VDDIO) M63.2(VDD) M63.4(S1) M63.13(VDDIO) M64.2(VDD) M64.4(S1) M64.13(VDDIO) M65.2(VDD) M65.4(S1) M65.13(VDDIO) M66.2(VDD) M66.4(S1) M66.13(VDDIO) M67.2(VDD) M67.4(S1) M67.13(VDDIO) M68.2(VDD) M68.4(S1) M68.13(VDDIO) M71.2(VDD) M71.4(S1) M71.13(VDDIO) M72.2(VDD) M72.4(S1) M72.13(VDDIO) M73.2(VDD) M73.4(S1) M73.13(VDDIO) M74.2(VDD) M74.4(S1) M74.13(VDDIO) M75.2(VDD) M75.4(S1) M75.13(VDDIO) M76.2(VDD) M76.4(S1) M76.13(VDDIO) M77.2(VDD) M77.4(S1) M77.13(VDDIO) M78.2(VDD) M78.4(S1) M78.13(VDDIO) M81.2(VDD) M81.4(S1) M81.13(VDDIO) M82.2(VDD) M82.4(S1) M82.13(VDDIO) M83.2(VDD) M83.4(S1) M83.13(VDDIO) M84.2(VDD) M84.4(S1) M84.13(VDDIO) M85.2(VDD) M85.4(S1) M85.13(VDDIO) M86.2(VDD) M86.4(S1) M86.13(VDDIO) M87.2(VDD) M87.4(S1) M87.13(VDDIO) M88.2(VDD) M88.4(S1) M88.13(VDDIO) R1.5 R1.6 R1.7 R1.8 R2.5 R2.6 R2.7 R2.8 R3.1 R3.2 R3.3 R3.4 R4.1 R4.2 R4.3 R4.4 R5.5 R5.6 R5.7 R5.8 R6.5 R6.6 R6.7 R6.8 R7.1 R7.2 R7.3 R7.4 R8.1 R8.2 R8.3 R8.4 R9.5 R9.6 R9.7 R9.8 R10.5 R10.6 R10.7 R10.8 R11.1 R11.2 R11.3 R11.4 R12.1 R12.2 R12.3 R12.4 R13.5 R13.6 R13.7 R13.8 R14.5 R14.6 R14.7 R14.8 R15.1 R15.2 R15.3 R15.4 R16.1 R16.2 R16.3 R16.4 R17.5 R17.6 R17.7 R17.8 R18.5 R18.6 R18.7 R18.8 R19.1 R19.2 R19.3 R19.4 R20.1 R20.2 R20.3 R20.4 R21.5 R21.6 R21.7 R21.8 R22.5 R22.6 R22.7 R22.8 R23.1 R23.2 R23.3 R23.4 R24.1 R24.2 R24.3 R24.4 R25.5 R25.6 R25.7 R25.8 R26.5 R26.6 R26.7 R26.8 R27.1 R27.2 R27.3 R27.4 R28.1 R28.2 R28.3 R28.4 R29.5 R29.6 R29.7 R29.8 R30.5 R30.6 R30.7 R30.8 R31.1 R31.2 R31.3 R31.4 R32.1 R32.2 R32.3 R32.4 SJ1.3 U1.24(VCC) U2.1(AD0) U2.24(VCC) U3.2(AD1) U3.24(VCC) U4.1(AD0) U4.2(AD1) U4.24(VCC) U5.21(AD2) U5.24(VCC) U6.1(AD0) U6.21(AD2) U6.24(VCC) U7.2(AD1) U7.21(AD2) U7.24(VCC) U8.1(AD0) U8.2(AD1) U8.21(AD2) U8.24(VCC) U9.5(OUT)
5V: CN1.6 SJ1.1 U9.1(IN) U9.3(EN)
GND: C1.2 C3.2 C4.2 C6.2 C7.2 C9.2 C10.2 C12.2 C13.2 C15.2 C16.2 C18.2 C19.2 C21.2 C22.2 C24.2 C25.2 C27.2 C28.2 C30.2 C31.2 C33.2 C34.2 C36.2 C37.2 C39.2 C40.2 C42.2 C43.2 C45.2 C46.2 C48.2 C49.2 C51.2 C52.2 C54.2 C55.2 C57.2 C58.2 C60.2 C61.2 C63.2 C64.2 C66.2 C67.2 C69.2 C70.2 C72.2 C73.2 C75.2 C76.2 C78.2 C79.2 C81.2 C82.2 C84.2 C85.2 C87.2 C88.2 C90.2 C91.2 C93.2 C94.2 C96.2 C97.2 C99.2 C100.2 C102.2 C103.2 C105.2 C106.2 C108.2 C109.2 C111.2 C112.2 C114.2 C115.2 C117.2 C118.2 C120.2 C121.2 C123.2 C124.2 C126.2 C127.2 C129.2 C130.2 C132.2 C133.2 C135.2 C136.2 C138.2 C139.2 C141.2 C142.2 C144.2 C145.2 C147.2 C148.2 C150.2 C151.2 C153.2 C154.2 C156.2 C157.2 C159.2 C160.2 C162.2 C163.2 C165.2 C166.2 C168.2 C169.2 C171.2 C172.2 C174.2 C175.2 C177.2 C178.2 C180.2 C181.2 C183.2 C184.2 C186.2 C187.2 C189.2 C190.2 C192.2 C193.2 C194.2 CN1.1 M11.9(GND) M11.11(GND) M12.9(GND) M12.11(GND) M13.9(GND) M13.11(GND) M14.9(GND) M14.11(GND) M15.9(GND) M15.11(GND) M16.9(GND) M16.11(GND) M17.9(GND) M17.11(GND) M18.9(GND) M18.11(GND) M21.9(GND) M21.11(GND) M22.9(GND) M22.11(GND) M23.9(GND) M23.11(GND) M24.9(GND) M24.11(GND) M25.9(GND) M25.11(GND) M26.9(GND) M26.11(GND) M27.9(GND) M27.11(GND) M28.9(GND) M28.11(GND) M31.9(GND) M31.11(GND) M32.9(GND) M32.11(GND) M33.9(GND) M33.11(GND) M34.9(GND) M34.11(GND) M35.9(GND) M35.11(GND) M36.9(GND) M36.11(GND) M37.9(GND) M37.11(GND) M38.9(GND) M38.11(GND) M41.9(GND) M41.11(GND) M42.9(GND) M42.11(GND) M43.9(GND) M43.11(GND) M44.9(GND) M44.11(GND) M45.9(GND) M45.11(GND) M46.9(GND) M46.11(GND) M47.9(GND) M47.11(GND) M48.9(GND) M48.11(GND) M51.9(GND) M51.11(GND) M52.9(GND) M52.11(GND) M53.9(GND) M53.11(GND) M54.9(GND) M54.11(GND) M55.9(GND) M55.11(GND) M56.9(GND) M56.11(GND) M57.9(GND) M57.11(GND) M58.9(GND) M58.11(GND) M61.9(GND) M61.11(GND) M62.9(GND) M62.11(GND) M63.9(GND) M63.11(GND) M64.9(GND) M64.11(GND) M65.9(GND) M65.11(GND) M66.9(GND) M66.11(GND) M67.9(GND) M67.11(GND) M68.9(GND) M68.11(GND) M71.9(GND) M71.11(GND) M72.9(GND) M72.11(GND) M73.9(GND) M73.11(GND) M74.9(GND) M74.11(GND) M75.9(GND) M75.11(GND) M76.9(GND) M76.11(GND) M77.9(GND) M77.11(GND) M78.9(GND) M78.11(GND) M81.9(GND) M81.11(GND) M82.9(GND) M82.11(GND) M83.9(GND) M83.11(GND) M84.9(GND) M84.11(GND) M85.9(GND) M85.11(GND) M86.9(GND) M86.11(GND) M87.9(GND) M87.11(GND) M88.9(GND) M88.11(GND) U1.1(AD0) U1.2(AD1) U1.12(GND) U1.21(AD2) U2.2(AD1) U2.12(GND) U2.21(AD2) U3.1(AD0) U3.12(GND) U3.21(AD2) U4.12(GND) U4.21(AD2) U5.1(AD0) U5.2(AD1) U5.12(GND) U6.2(AD1) U6.12(GND) U7.1(AD0) U7.12(GND) U8.12(GND) U9.2(GND)
N$1: C4.1 M12.10(C1)
N$2: C5.1 M12.12(SETC)
N$3: C5.2 M12.8(SETP)
N$4: C7.1 M13.10(C1)
N$5: C8.1 M13.12(SETC)
N$6: C1.1 M11.10(C1)
N$7: C8.2 M13.8(SETP)
N$8: C10.1 M14.10(C1)
N$9: C2.1 M11.12(SETC)
N$10: C2.2 M11.8(SETP)
N$11: C11.1 M14.12(SETC)
N$12: C11.2 M14.8(SETP)
N$13: C13.1 M15.10(C1)
N$14: C14.1 M15.12(SETC)
N$15: C14.2 M15.8(SETP)
N$16: C16.1 M16.10(C1)
N$17: C17.1 M16.12(SETC)
N$18: C17.2 M16.8(SETP)
N$19: C19.1 M17.10(C1)
N$20: C20.1 M17.12(SETC)
N$21: C20.2 M17.8(SETP)
N$22: C22.1 M18.10(C1)
N$23: C23.1 M18.12(SETC)
N$24: C23.2 M18.8(SETP)
N$25: C25.1 M21.10(C1)
N$26: C26.1 M21.12(SETC)
N$27: C26.2 M21.8(SETP)
N$28: C28.1 M22.10(C1)
N$29: C29.1 M22.12(SETC)
N$30: C29.2 M22.8(SETP)
N$31: C31.1 M23.10(C1)
N$32: C32.1 M23.12(SETC)
N$33: C32.2 M23.8(SETP)
N$34: C34.1 M24.10(C1)
N$35: C35.1 M24.12(SETC)
N$36: C35.2 M24.8(SETP)
N$37: C37.1 M25.10(C1)
N$38: C38.1 M25.12(SETC)
N$39: C38.2 M25.8(SETP)
N$40: C40.1 M26.10(C1)
N$41: C41.1 M26.12(SETC)
N$42: C41.2 M26.8(SETP)
N$43: C43.1 M27.10(C1)
N$44: C44.1 M27.12(SETC)
N$45: C44.2 M27.8(SETP)
N$46: C46.1 M28.10(C1)
N$47: C47.1 M28.12(SETC)
N$48: C47.2 M28.8(SETP)
N$49: C49.1 M31.10(C1)
N$50: C50.1 M31.12(SETC)
N$51: C50.2 M31.8(SETP)
N$52: C52.1 M32.10(C1)
N$53: C53.1 M32.12(SETC)
N$54: C53.2 M32.8(SETP)
N$55: C55.1 M33.10(C1)
N$56: C56.1 M33.12(SETC)
N$57: C56.2 M33.8(SETP)
N$58: C58.1 M34.10(C1)
N$59: C59.1 M34.12(SETC)
N$60: C59.2 M34.8(SETP)
N$61: C61.1 M35.10(C1)
N$62: C62.1 M35.12(SETC)
N$63: C62.2 M35.8(SETP)
N$64: C64.1 M36.10(C1)
N$65: C65.1 M36.12(SETC)
N$66: C65.2 M36.8(SETP)
N$67: C67.1 M37.10(C1)
N$68: C68.1 M37.12(SETC)
N$69: C68.2 M37.8(SETP)
N$70: C70.1 M38.10(C1)
N$71: C71.1 M38.12(SETC)
N$72: C71.2 M38.8(SETP)
N$73: C73.1 M41.10(C1)
N$74: C74.1 M41.12(SETC)
N$75: C74.2 M41.8(SETP)
N$76: C76.1 M42.10(C1)
N$77: C77.1 M42.12(SETC)
N$78: C77.2 M42.8(SETP)
N$79: C79.1 M43.10(C1)
N$80: C80.1 M43.12(SETC)
N$81: C80.2 M43.8(SETP)
N$82: C82.1 M44.10(C1)
N$83: C83.1 M44.12(SETC)
N$84: C83.2 M44.8(SETP)
N$85: C85.1 M45.10(C1)
N$86: C86.1 M45.12(SETC)
N$87: C86.2 M45.8(SETP)
N$88: C88.1 M46.10(C1)
N$89: C89.1 M46.12(SETC)
N$90: C89.2 M46.8(SETP)
N$91: C91.1 M47.10(C1)
N$92: C92.1 M47.12(SETC)
N$93: C92.2 M47.8(SETP)
N$94: C94.1 M48.10(C1)
N$95: C95.1 M48.12(SETC)
N$96: C95.2 M48.8(SETP)
N$97: C97.1 M51.10(C1)
N$98: C98.1 M51.12(SETC)
N$99: C98.2 M51.8(SETP)
N$100: C100.1 M52.10(C1)
N$101: C101.1 M52.12(SETC)
N$102: C101.2 M52.8(SETP)
N$103: C103.1 M53.10(C1)
N$104: C104.1 M53.12(SETC)
N$105: C104.2 M53.8(SETP)
N$106: C106.1 M54.10(C1)
N$107: C107.1 M54.12(SETC)
N$108: C107.2 M54.8(SETP)
N$109: C109.1 M55.10(C1)
N$110: C110.1 M55.12(SETC)
N$111: C110.2 M55.8(SETP)
N$112: C112.1 M56.10(C1)
N$113: C113.1 M56.12(SETC)
N$114: C113.2 M56.8(SETP)
N$115: C115.1 M57.10(C1)
N$116: C116.1 M57.12(SETC)
N$117: C116.2 M57.8(SETP)
N$118: C118.1 M58.10(C1)
N$119: C119.1 M58.12(SETC)
N$120: C119.2 M58.8(SETP)
N$121: C121.1 M61.10(C1)
N$122: C122.1 M61.12(SETC)
N$123: C122.2 M61.8(SETP)
N$124: C124.1 M62.10(C1)
N$125: C125.1 M62.12(SETC)
N$126: C125.2 M62.8(SETP)
N$127: C127.1 M63.10(C1)
N$128: C128.1 M63.12(SETC)
N$129: C128.2 M63.8(SETP)
N$130: C130.1 M64.10(C1)
N$131: C131.1 M64.12(SETC)
N$132: C131.2 M64.8(SETP)
N$133: C133.1 M65.10(C1)
N$134: C134.1 M65.12(SETC)
N$135: C134.2 M65.8(SETP)
N$136: C136.1 M66.10(C1)
N$137: C137.1 M66.12(SETC)
N$138: C137.2 M66.8(SETP)
N$139: C139.1 M67.10(C1)
N$140: C140.1 M67.12(SETC)
N$141: C140.2 M67.8(SETP)
N$142: C142.1 M68.10(C1)
N$143: C143.1 M68.12(SETC)
N$144: C143.2 M68.8(SETP)
N$145: C145.1 M71.10(C1)
N$146: C146.1 M71.12(SETC)
N$147: C146.2 M71.8(SETP)
N$148: C148.1 M72.10(C1)
N$149: C149.1 M72.12(SETC)
N$150: C149.2 M72.8(SETP)
N$151: C151.1 M73.10(C1)
N$152: C152.1 M73.12(SETC)
N$153: C152.2 M73.8(SETP)
N$154: C154.1 M74.10(C1)
N$155: C155.1 M74.12(SETC)
N$156: C155.2 M74.8(SETP)
N$157: C157.1 M75.10(C1)
N$158: C158.1 M75.12(SETC)
N$159: C158.2 M75.8(SETP)
N$160: C160.1 M76.10(C1)
N$161: C161.1 M76.12(SETC)
N$162: C161.2 M76.8(SETP)
N$163: C163.1 M77.10(C1)
N$164: C164.1 M77.12(SETC)
N$165: C164.2 M77.8(SETP)
N$166: C166.1 M78.10(C1)
N$167: C167.1 M78.12(SETC)
N$168: C167.2 M78.8(SETP)
N$169: C169.1 M81.10(C1)
N$170: C170.1 M81.12(SETC)
N$171: C170.2 M81.8(SETP)
N$172: C172.1 M82.10(C1)
N$173: C173.1 M82.12(SETC)
N$174: C173.2 M82.8(SETP)
N$175: C175.1 M83.10(C1)
N$176: C176.1 M83.12(SETC)
N$177: C176.2 M83.8(SETP)
N$178: C178.1 M84.10(C1)
N$179: C179.1 M84.12(SETC)
N$180: C179.2 M84.8(SETP)
N$181: C181.1 M85.10(C1)
N$182: C182.1 M85.12(SETC)
N$183: C182.2 M85.8(SETP)
N$184: C184.1 M86.10(C1)
N$185: C185.1 M86.12(SETC)
N$186: C185.2 M86.8(SETP)
N$187: C187.1 M87.10(C1)
N$188: C188.1 M87.12(SETC)
N$189: C188.2 M87.8(SETP)
N$190: C190.1 M88.10(C1)
N$191: C191.1 M88.12(SETC)
N$192: C191.2 M88.8(SETP)
N$193: C193.1 U9.4(BP)
N$194: R33.2 R34.2 SJ1.2
RESET: CN1.4 U1.3(RST#) U2.3(RST#) U3.3(RST#) U4.3(RST#) U5.3(RST#) U6.3(RST#) U7.3(RST#) U8.3(RST#)
SCL: CN1.2 R34.1 U1.22(SCL) U2.22(SCL) U3.22(SCL) U4.22(SCL) U5.22(SCL) U6.22(SCL) U7.22(SCL) U8.22(SCL)
SCL11: M11.1(SCL) R3.5 U1.20(SCL7)
SCL12: M12.1(SCL) R3.7 U1.18(SCL6)
SCL13: M13.1(SCL) R4.5 U1.16(SCL5)
SCL14: M14.1(SCL) R4.7 U1.14(SCL4)
SCL15: M15.1(SCL) R1.3 U1.5(SCL0)
SCL16: M16.1(SCL) R1.1 U1.7(SCL1)
SCL17: M17.1(SCL) R2.3 U1.9(SCL2)
SCL18: M18.1(SCL) R2.1 U1.11(SCL3)
SCL21: M21.1(SCL) R7.5 U2.20(SCL7)
SCL22: M22.1(SCL) R7.7 U2.18(SCL6)
SCL23: M23.1(SCL) R8.5 U2.16(SCL5)
SCL24: M24.1(SCL) R8.7 U2.14(SCL4)
SCL25: M25.1(SCL) R5.3 U2.5(SCL0)
SCL26: M26.1(SCL) R5.1 U2.7(SCL1)
SCL27: M27.1(SCL) R6.3 U2.9(SCL2)
SCL28: M28.1(SCL) R6.1 U2.11(SCL3)
SCL31: M31.1(SCL) R11.5 U3.20(SCL7)
SCL32: M32.1(SCL) R11.7 U3.18(SCL6)
SCL33: M33.1(SCL) R12.5 U3.16(SCL5)
SCL34: M34.1(SCL) R12.7 U3.14(SCL4)
SCL35: M35.1(SCL) R9.3 U3.5(SCL0)
SCL36: M36.1(SCL) R9.1 U3.7(SCL1)
SCL37: M37.1(SCL) R10.3 U3.9(SCL2)
SCL38: M38.1(SCL) R10.1 U3.11(SCL3)
SCL41: M41.1(SCL) R15.5 U4.20(SCL7)
SCL42: M42.1(SCL) R15.7 U4.18(SCL6)
SCL43: M43.1(SCL) R16.5 U4.16(SCL5)
SCL44: M44.1(SCL) R16.7 U4.14(SCL4)
SCL45: M45.1(SCL) R13.3 U4.5(SCL0)
SCL46: M46.1(SCL) R13.1 U4.7(SCL1)
SCL47: M47.1(SCL) R14.3 U4.9(SCL2)
SCL48: M48.1(SCL) R14.1 U4.11(SCL3)
SCL51: M51.1(SCL) R19.5 U5.20(SCL7)
SCL52: M52.1(SCL) R19.7 U5.18(SCL6)
SCL53: M53.1(SCL) R20.5 U5.16(SCL5)
SCL54: M54.1(SCL) R20.7 U5.14(SCL4)
SCL55: M55.1(SCL) R17.3 U5.5(SCL0)
SCL56: M56.1(SCL) R17.1 U5.7(SCL1)
SCL57: M57.1(SCL) R18.3 U5.9(SCL2)
SCL58: M58.1(SCL) R18.1 U5.11(SCL3)
SCL61: M61.1(SCL) R23.5 U6.20(SCL7)
SCL62: M62.1(SCL) R23.7 U6.18(SCL6)
SCL63: M63.1(SCL) R24.5 U6.16(SCL5)
SCL64: M64.1(SCL) R24.7 U6.14(SCL4)
SCL65: M65.1(SCL) R21.3 U6.5(SCL0)
SCL66: M66.1(SCL) R21.1 U6.7(SCL1)
SCL67: M67.1(SCL) R22.3 U6.9(SCL2)
SCL68: M68.1(SCL) R22.1 U6.11(SCL3)
SCL71: M71.1(SCL) R27.5 U7.20(SCL7)
SCL72: M72.1(SCL) R27.7 U7.18(SCL6)
SCL73: M73.1(SCL) R28.5 U7.16(SCL5)
SCL74: M74.1(SCL) R28.7 U7.14(SCL4)
SCL75: M75.1(SCL) R25.3 U7.5(SCL0)
SCL76: M76.1(SCL) R25.1 U7.7(SCL1)
SCL77: M77.1(SCL) R26.3 U7.9(SCL2)
SCL78: M78.1(SCL) R26.1 U7.11(SCL3)
SCL81: M81.1(SCL) R31.5 U8.20(SCL7)
SCL82: M82.1(SCL) R31.7 U8.18(SCL6)
SCL83: M83.1(SCL) R32.5 U8.16(SCL5)
SCL84: M84.1(SCL) R32.7 U8.14(SCL4)
SCL85: M85.1(SCL) R29.3 U8.5(SCL0)
SCL86: M86.1(SCL) R29.1 U8.7(SCL1)
SCL87: M87.1(SCL) R30.3 U8.9(SCL2)
SCL88: M88.1(SCL) R30.1 U8.11(SCL3)
SDA: CN1.3 R33.1 U1.23(SDA) U2.23(SDA) U3.23(SDA) U4.23(SDA) U5.23(SDA) U6.23(SDA) U7.23(SDA) U8.23(SDA)
SDA11: M11.16(SDA) R3.6 U1.19(SDA7)
SDA12: M12.16(SDA) R3.8 U1.17(SDA6)
SDA13: M13.16(SDA) R4.6 U1.15(SDA5)
SDA14: M14.16(SDA) R4.8 U1.13(SDA4)
SDA15: M15.16(SDA) R1.4 U1.4(SDA0)
SDA16: M16.16(SDA) R1.2 U1.6(SDA1)
SDA17: M17.16(SDA) R2.4 U1.8(SDA2)
SDA18: M18.16(SDA) R2.2 U1.10(SDA3)
SDA21: M21.16(SDA) R7.6 U2.19(SDA7)
SDA22: M22.16(SDA) R7.8 U2.17(SDA6)
SDA23: M23.16(SDA) R8.6 U2.15(SDA5)
SDA24: M24.16(SDA) R8.8 U2.13(SDA4)
SDA25: M25.16(SDA) R5.4 U2.4(SDA0)
SDA26: M26.16(SDA) R5.2 U2.6(SDA1)
SDA27: M27.16(SDA) R6.4 U2.8(SDA2)
SDA28: M28.16(SDA) R6.2 U2.10(SDA3)
SDA31: M31.16(SDA) R11.6 U3.19(SDA7)
SDA32: M32.16(SDA) R11.8 U3.17(SDA6)
SDA33: M33.16(SDA) R12.6 U3.15(SDA5)
SDA34: M34.16(SDA) R12.8 U3.13(SDA4)
SDA35: M35.16(SDA) R9.4 U3.4(SDA0)
SDA36: M36.16(SDA) R9.2 U3.6(SDA1)
SDA37: M37.16(SDA) R10.4 U3.8(SDA2)
SDA38: M38.16(SDA) R10.2 U3.10(SDA3)
SDA41: M41.16(SDA) R15.6 U4.19(SDA7)
SDA42: M42.16(SDA) R15.8 U4.17(SDA6)
SDA43: M43.16(SDA) R16.6 U4.15(SDA5)
SDA44: M44.16(SDA) R16.8 U4.13(SDA4)
SDA45: M45.16(SDA) R13.4 U4.4(SDA0)
SDA46: M46.16(SDA) R13.2 U4.6(SDA1)
SDA47: M47.16(SDA) R14.4 U4.8(SDA2)
SDA48: M48.16(SDA) R14.2 U4.10(SDA3)
SDA51: M51.16(SDA) R19.6 U5.19(SDA7)
SDA52: M52.16(SDA) R19.8 U5.17(SDA6)
SDA53: M53.16(SDA) R20.6 U5.15(SDA5)
SDA54: M54.16(SDA) R20.8 U5.13(SDA4)
SDA55: M55.16(SDA) R17.4 U5.4(SDA0)
SDA56: M56.16(SDA) R17.2 U5.6(SDA1)
SDA57: M57.16(SDA) R18.4 U5.8(SDA2)
SDA58: M58.16(SDA) R18.2 U5.10(SDA3)
SDA61: M61.16(SDA) R23.6 U6.19(SDA7)
SDA62: M62.16(SDA) R23.8 U6.17(SDA6)
SDA63: M63.16(SDA) R24.6 U6.15(SDA5)
SDA64: M64.16(SDA) R24.8 U6.13(SDA4)
SDA65: M65.16(SDA) R21.4 U6.4(SDA0)
SDA66: M66.16(SDA) R21.2 U6.6(SDA1)
SDA67: M67.16(SDA) R22.4 U6.8(SDA2)
SDA68: M68.16(SDA) R22.2 U6.10(SDA3)
SDA71: M71.16(SDA) R27.6 U7.19(SDA7)
SDA72: M72.16(SDA) R27.8 U7.17(SDA6)
SDA73: M73.16(SDA) R28.6 U7.15(SDA5)
SDA74: M74.16(SDA) R28.8 U7.13(SDA4)
SDA75: M75.16(SDA) R25.4 U7.4(SDA0)
SDA76: M76.16(SDA) R25.2 U7.6(SDA1)
SDA77: M77.16(SDA) R26.4 U7.8(SDA2)
SDA78: M78.16(SDA) R26.2 U7.10(SDA3)
SDA81: M81.16(SDA) R31.6 U8.19(SDA7)
SDA82: M82.16(SDA) R31.8 U8.17(SDA6)
SDA83: M83.16(SDA) R32.6 U8.15(SDA5)
SDA84: M84.16(SDA) R32.8 U8.13(SDA4)
SDA85: M85.16(SDA) R29.4 U8.4(SDA0)
SDA86: M86.16(SDA) R29.2 U8.6(SDA1)
SDA87: M87.16(SDA) R30.4 U8.8(SDA2)
SDA88: M88.16(SDA) R30.2 U8.10(SDA3)
Unconnected: M11.3(NC) M11.5(NC) M11.6(NC) M11.7(NC) M11.14(NC) M11.15(DRDY) M12.3(NC) M12.5(NC) M12.6(NC) M12.7(NC) M12.14(NC) M12.15(DRDY) M13.3(NC) M13.5(NC) M13.6(NC) M13.7(NC) M13.14(NC) M13.15(DRDY) M14.3(NC) M14.5(NC) M14.6(NC) M14.7(NC) M14.14(NC) M14.15(DRDY) M15.3(NC) M15.5(NC) M15.6(NC) M15.7(NC) M15.14(NC) M15.15(DRDY) M16.3(NC) M16.5(NC) M16.6(NC) M16.7(NC) M16.14(NC) M16.15(DRDY) M17.3(NC) M17.5(NC) M17.6(NC) M17.7(NC) M17.14(NC) M17.15(DRDY) M18.3(NC) M18.5(NC) M18.6(NC) M18.7(NC) M18.14(NC) M18.15(DRDY) M21.3(NC) M21.5(NC) M21.6(NC) M21.7(NC) M21.14(NC) M21.15(DRDY) M22.3(NC) M22.5(NC) M22.6(NC) M22.7(NC) M22.14(NC) M22.15(DRDY) M23.3(NC) M23.5(NC) M23.6(NC) M23.7(NC) M23.14(NC) M23.15(DRDY) M24.3(NC) M24.5(NC) M24.6(NC) M24.7(NC) M24.14(NC) M24.15(DRDY) M25.3(NC) M25.5(NC) M25.6(NC) M25.7(NC) M25.14(NC) M25.15(DRDY) M26.3(NC) M26.5(NC) M26.6(NC) M26.7(NC) M26.14(NC) M26.15(DRDY) M27.3(NC) M27.5(NC) M27.6(NC) M27.7(NC) M27.14(NC) M27.15(DRDY) M28.3(NC) M28.5(NC) M28.6(NC) M28.7(NC) M28.14(NC) M28.15(DRDY) M31.3(NC) M31.5(NC) M31.6(NC) M31.7(NC) M31.14(NC) M31.15(DRDY) M32.3(NC) M32.5(NC) M32.6(NC) M32.7(NC) M32.14(NC) M32.15(DRDY) M33.3(NC) M33.5(NC) M33.6(NC) M33.7(NC) M33.14(NC) M33.15(DRDY) M34.3(NC) M34.5(NC) M34.6(NC) M34.7(NC) M34.14(NC) M34.15(DRDY) M35.3(NC) M35.5(NC) M35.6(NC) M35.7(NC) M35.14(NC) M35.15(DRDY) M36.3(NC) M36.5(NC) M36.6(NC) M36.7(NC) M36.14(NC) M36.15(DRDY) M37.3(NC) M37.5(NC) M37.6(NC) M37.7(NC) M37.14(NC) M37.15(DRDY) M38.3(NC) M38.5(NC) M38.6(NC) M38.7(NC) M38.14(NC) M38.15(DRDY) M41.3(NC) M41.5(NC) M41.6(NC) M41.7(NC) M41.14(NC) M41.15(DRDY) M42.3(NC) M42.5(NC) M42.6(NC) M42.7(NC) M42.14(NC) M42.15(DRDY) M43.3(NC) M43.5(NC) M43.6(NC) M43.7(NC) M43.14(NC) M43.15(DRDY) M44.3(NC) M44.5(NC) M44.6(NC) M44.7(NC) M44.14(NC) M44.15(DRDY) M45.3(NC) M45.5(NC) M45.6(NC) M45.7(NC) M45.14(NC) M45.15(DRDY) M46.3(NC) M46.5(NC) M46.6(NC) M46.7(NC) M46.14(NC) M46.15(DRDY) M47.3(NC) M47.5(NC) M47.6(NC) M47.7(NC) M47.14(NC) M47.15(DRDY) M48.3(NC) M48.5(NC) M48.6(NC) M48.7(NC) M48.14(NC) M48.15(DRDY) M51.3(NC) M51.5(NC) M51.6(NC) M51.7(NC) M51.14(NC) M51.15(DRDY) M52.3(NC) M52.5(NC) M52.6(NC) M52.7(NC) M52.14(NC) M52.15(DRDY) M53.3(NC) M53.5(NC) M53.6(NC) M53.7(NC) M53.14(NC) M53.15(DRDY) M54.3(NC) M54.5(NC) M54.6(NC) M54.7(NC) M54.14(NC) M54.15(DRDY) M55.3(NC) M55.5(NC) M55.6(NC) M55.7(NC) M55.14(NC) M55.15(DRDY) M56.3(NC) M56.5(NC) M56.6(NC) M56.7(NC) M56.14(NC) M56.15(DRDY) M57.3(NC) M57.5(NC) M57.6(NC) M57.7(NC) M57.14(NC) M57.15(DRDY) M58.3(NC) M58.5(NC) M58.6(NC) M58.7(NC) M58.14(NC) M58.15(DRDY) M61.3(NC) M61.5(NC) M61.6(NC) M61.7(NC) M61.14(NC) M61.15(DRDY) M62.3(NC) M62.5(NC) M62.6(NC) M62.7(NC) M62.14(NC) M62.15(DRDY) M63.3(NC) M63.5(NC) M63.6(NC) M63.7(NC) M63.14(NC) M63.15(DRDY) M64.3(NC) M64.5(NC) M64.6(NC) M64.7(NC) M64.14(NC) M64.15(DRDY) M65.3(NC) M65.5(NC) M65.6(NC) M65.7(NC) M65.14(NC) M65.15(DRDY) M66.3(NC) M66.5(NC) M66.6(NC) M66.7(NC) M66.14(NC) M66.15(DRDY) M67.3(NC) M67.5(NC) M67.6(NC) M67.7(NC) M67.14(NC) M67.15(DRDY) M68.3(NC) M68.5(NC) M68.6(NC) M68.7(NC) M68.14(NC) M68.15(DRDY) M71.3(NC) M71.5(NC) M71.6(NC) M71.7(NC) M71.14(NC) M71.15(DRDY) M72.3(NC) M72.5(NC) M72.6(NC) M72.7(NC) M72.14(NC) M72.15(DRDY) M73.3(NC) M73.5(NC) M73.6(NC) M73.7(NC) M73.14(NC) M73.15(DRDY) M74.3(NC) M74.5(NC) M74.6(NC) M74.7(NC) M74.14(NC) M74.15(DRDY) M75.3(NC) M75.5(NC) M75.6(NC) M75.7(NC) M75.14(NC) M75.15(DRDY) M76.3(NC) M76.5(NC) M76.6(NC) M76.7(NC) M76.14(NC) M76.15(DRDY) M77.3(NC) M77.5(NC) M77.6(NC) M77.7(NC) M77.14(NC) M77.15(DRDY) M78.3(NC) M78.5(NC) M78.6(NC) M78.7(NC) M78.14(NC) M78.15(DRDY) M81.3(NC) M81.5(NC) M81.6(NC) M81.7(NC) M81.14(NC) M81.15(DRDY) M82.3(NC) M82.5(NC) M82.6(NC) M82.7(NC) M82.14(NC) M82.15(DRDY) M83.3(NC) M83.5(NC) M83.6(NC) M83.7(NC) M83.14(NC) M83.15(DRDY) M84.3(NC) M84.5(NC) M84.6(NC) M84.7(NC) M84.14(NC) M84.15(DRDY) M85.3(NC) M85.5(NC) M85.6(NC) M85.7(NC) M85.14(NC) M85.15(DRDY) M86.3(NC) M86.5(NC) M86.6(NC) M86.7(NC) M86.14(NC) M86.15(DRDY) M87.3(NC) M87.5(NC) M87.6(NC) M87.7(NC) M87.14(NC) M87.15(DRDY) M88.3(NC) M88.5(NC) M88.6(NC) M88.7(NC) M88.14(NC) M88.15(DRDY)

## Notes on the sheet
- (I2C_ADDR: 0x1E) | (I2C_ADDR: 0x1E) | (I2C_ADDR: 0x1E) | (I2C_ADDR: 0x1E) | (I2C_ADDR: 0x1E) | (I2C_ADDR: 0x1E) | (I2C_ADDR: 0x1E) | (I2C_ADDR: 0x1E)
- (I2C_ADDR: 0x1E) | (I2C_ADDR: 0x1E) | (I2C_ADDR: 0x1E) | (I2C_ADDR: 0x1E) | (I2C_ADDR: 0x1E) | (I2C_ADDR: 0x1E) | (I2C_ADDR: 0x1E) | (I2C_ADDR: 0x1E)
- (I2C_ADDR: 0x1E) | (I2C_ADDR: 0x1E) | (I2C_ADDR: 0x1E) | (I2C_ADDR: 0x1E) | (I2C_ADDR: 0x1E) | (I2C_ADDR: 0x1E) | (I2C_ADDR: 0x1E) | (I2C_ADDR: 0x1E)
- 3.3V REGULATOR
- (I2C_ADDR: 0x1E) | (I2C_ADDR: 0x1E) | (I2C_ADDR: 0x1E) | (I2C_ADDR: 0x1E) | (I2C_ADDR: 0x1E) | (I2C_ADDR: 0x1E) | (I2C_ADDR: 0x1E) | (I2C_ADDR: 0x1E)
- (I2C_ADDR: 0x1E) | (I2C_ADDR: 0x1E) | (I2C_ADDR: 0x1E) | (I2C_ADDR: 0x1E) | (I2C_ADDR: 0x1E) | (I2C_ADDR: 0x1E) | (I2C_ADDR: 0x1E) | (I2C_ADDR: 0x1E)
- (I2C_ADDR: 0x1E) | (I2C_ADDR: 0x1E) | (I2C_ADDR: 0x1E) | (I2C_ADDR: 0x1E) | (I2C_ADDR: 0x1E) | (I2C_ADDR: 0x1E) | (I2C_ADDR: 0x1E) | (I2C_ADDR: 0x1E)
- (I2C_ADDR: 0x1E) | (I2C_ADDR: 0x1E) | (I2C_ADDR: 0x1E) | (I2C_ADDR: 0x1E) | (I2C_ADDR: 0x1E) | (I2C_ADDR: 0x1E) | (I2C_ADDR: 0x1E) | (I2C_ADDR: 0x1E)
- (I2C_ADDR: 0x1E) | (I2C_ADDR: 0x1E) | (I2C_ADDR: 0x1E) | (I2C_ADDR: 0x1E) | (I2C_ADDR: 0x1E) | (I2C_ADDR: 0x1E) | (I2C_ADDR: 0x1E) | (I2C_ADDR: 0x1E)

## Library data of the parts
C1-C194 = notes_mark5:CAP: Capacitor Standard 0603 ceramic capacitor, and 0.1" leaded capacitor.
CN1 = notes_mark5a1:1X06
M11-M18 M21-M28 M31-M38 M41-M48 M51-M58 M61-M68 M71-M78 M81-M88 = SparkFun-Sensors:HMC5883L: 3 Axis Digital Compass IC
R1-R32 = SparkFun-Passives:RESISTOR-ARRAY: Array Chip Resistor Source: RS Component / Phycomp
R33 R34 = notes_mark5a:RESISTOR: Resistor Basic schematic elements and footprints for 0603, 1206, and PTH 1/10th watt (small) resistors.
SJ1 = SparkFun-Passives:SOLDERJUMPER_2WAY: Solder Jumper 2 way solder jumper
U1-U8 = notes_mark5a1:TCA9548A: TI PCA9548A 8-Channel I2C Multiplexer/Switch
U9 = SparkFun-PowerIC:V_REG_LDO: Voltage Regulator LDO Standard 150mA LDO voltage regulator in SOT-23 layout. Micrel part MIC5205. BP (by-pass) pin is used to lower output noise with 470pF cap.